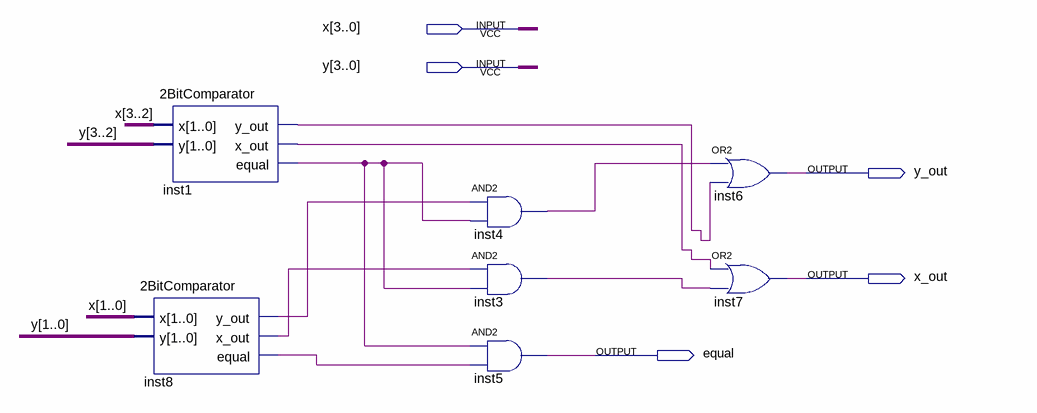
[diagram p0: schematic sheet]
// Quartus schematic 4BitComparator.bdf as structural Verilog: 7 symbols, 5 pins
module \4BitComparator  (
  input  [3:0] x,
  input  [3:0] y,
  output y_out,
  output x_out,
  output equal
);

  wire inst1_equal, inst1_x_out, inst1_y_out, inst3_out, inst4_out, inst8_equal, inst8_x_out, inst8_y_out;

  \2BitComparator  inst1 (.x(x[3:2]), .y(y[3:2]), .y_out(inst1_y_out), .x_out(inst1_x_out), .equal(inst1_equal));
  \2BitComparator  inst8 (.x(x[1:0]), .y(y[1:0]), .y_out(inst8_y_out), .x_out(inst8_x_out), .equal(inst8_equal));
  and inst4 (inst4_out, inst8_y_out, inst1_equal);
  and inst3 (inst3_out, inst8_x_out, inst1_equal);
  and inst5 (equal, inst1_equal, inst8_equal);
  or inst6 (y_out, inst4_out, inst1_y_out);
  or inst7 (x_out, inst1_x_out, inst3_out);
endmodule
